# EAGLE design RGBW_controller (EAGLE 9.1.3)
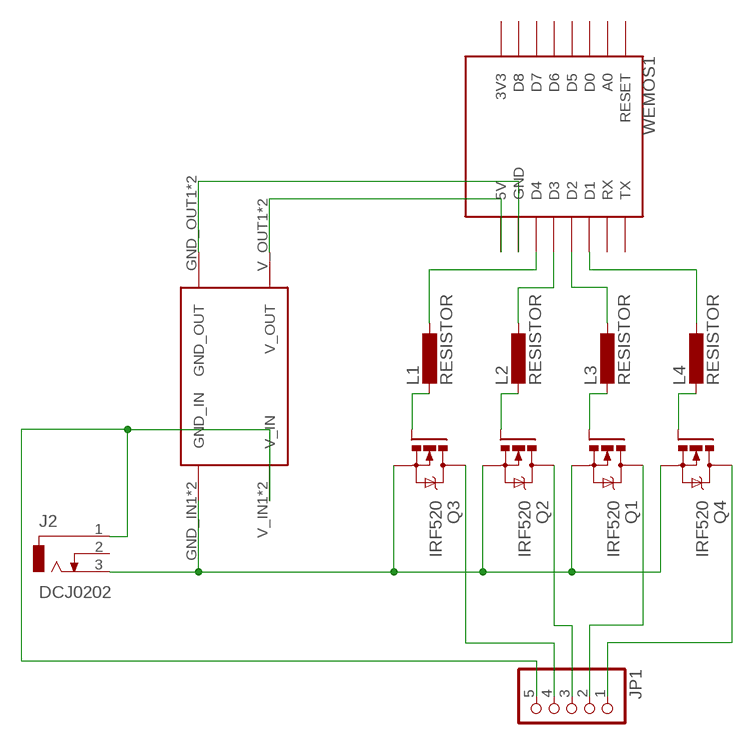
[diagram p0: schematic, sheet 1]

## Parts
J2  DCJ0202  [DCJ0202]
JP1  PINHD-1X5  [1X05]
L1  RESISTOR  [RESISTOR]
L2  RESISTOR  [RESISTOR]
L3  RESISTOR  [RESISTOR]
L4  RESISTOR  [RESISTOR]
Q1  IRF520  [TO220BV]
Q2  IRF520  [TO220BV]
Q3  IRF520  [TO220BV]
Q4  IRF520  [TO220BV]
U$1  DC-DC-CONVERTER  [DC-DC-CONVERTER]
WEMOS1  WEMOS-D1-MINI  [WEMOS-D1-MINI]

## Nets
N$1: L4.2 Q4.G
N$2: J2.3 Q1.S Q2.S Q3.S Q4.S U$1.GND_IN1(GND_IN) U$1.GND_IN2(GND_IN)
N$3: JP1.4 Q3.D
N$4: J2.1 JP1.5 U$1.V_IN1(V_IN) U$1.V_IN2(V_IN)
N$5: L1.2 Q3.G
N$6: L2.2 Q2.G
N$7: L3.2 Q1.G
N$8: L4.1 WEMOS1.D1
N$9: L3.1 WEMOS1.D2
N$10: L2.1 WEMOS1.D3
N$11: L1.1 WEMOS1.D4
N$12: U$1.V_OUT1(V_OUT) U$1.V_OUT2(V_OUT) WEMOS1.5V
N$13: U$1.GND_OUT1(GND_OUT) U$1.GND_OUT2(GND_OUT) WEMOS1.GND
N$14: JP1.3 Q2.D
N$15: JP1.2 Q1.D
N$16: JP1.1 Q4.D
Unconnected: J2.2 WEMOS1.3V3 WEMOS1.A0 WEMOS1.D0 WEMOS1.D5 WEMOS1.D6 WEMOS1.D7 WEMOS1.D8 WEMOS1.RESET WEMOS1.RX WEMOS1.TX

## Library data of the parts
J2 = con-jack:DCJ0202: DC POWER JACK Source: DCJ0202.pdf; OC_FARNELL: unknown; OC_NEWARK: unknown
JP1 = pinhead:PINHD-1X5: PIN HEADER
L1-L4 = mylib:RESISTOR
Q1-Q4 = transistor-power:IRF520: HEXFET Power MOSFET
U$1 = mylib:DC-DC-CONVERTER
WEMOS1 = esp8266modules:WEMOS-D1-MINI: WeMos.cc D1 mini ESP8266 module

## Board
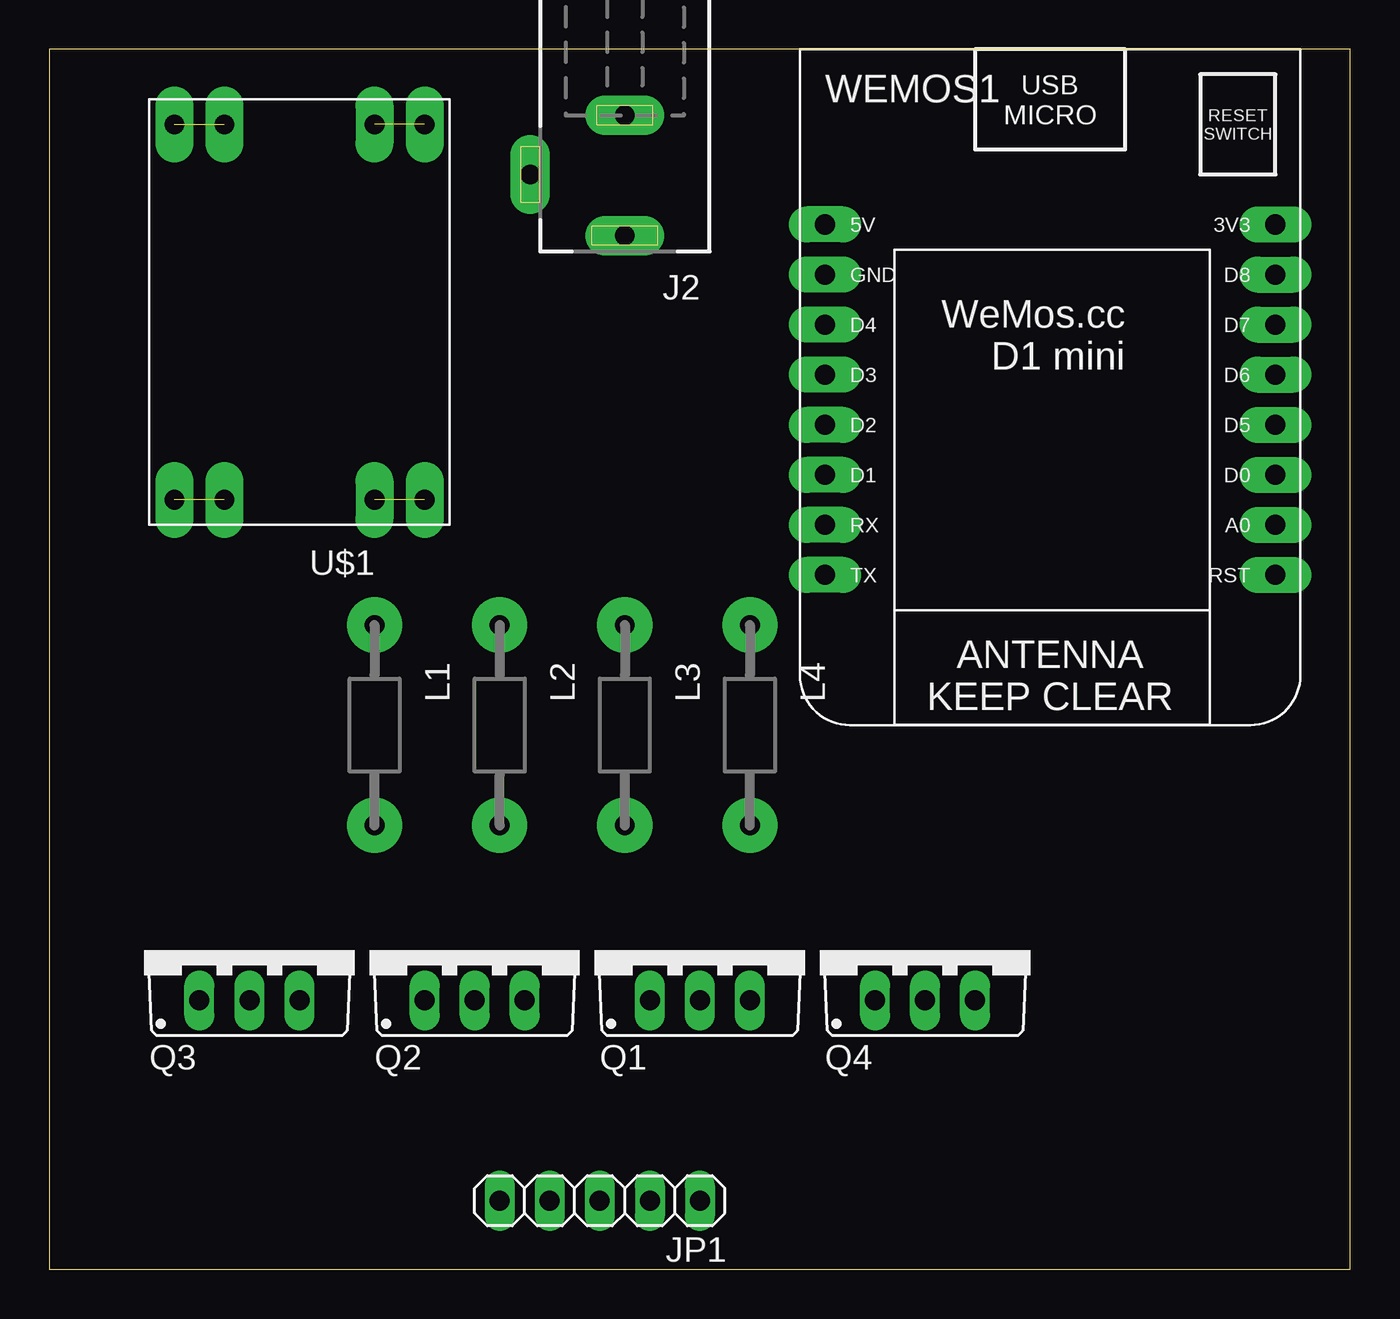
[diagram p1: board, top side]
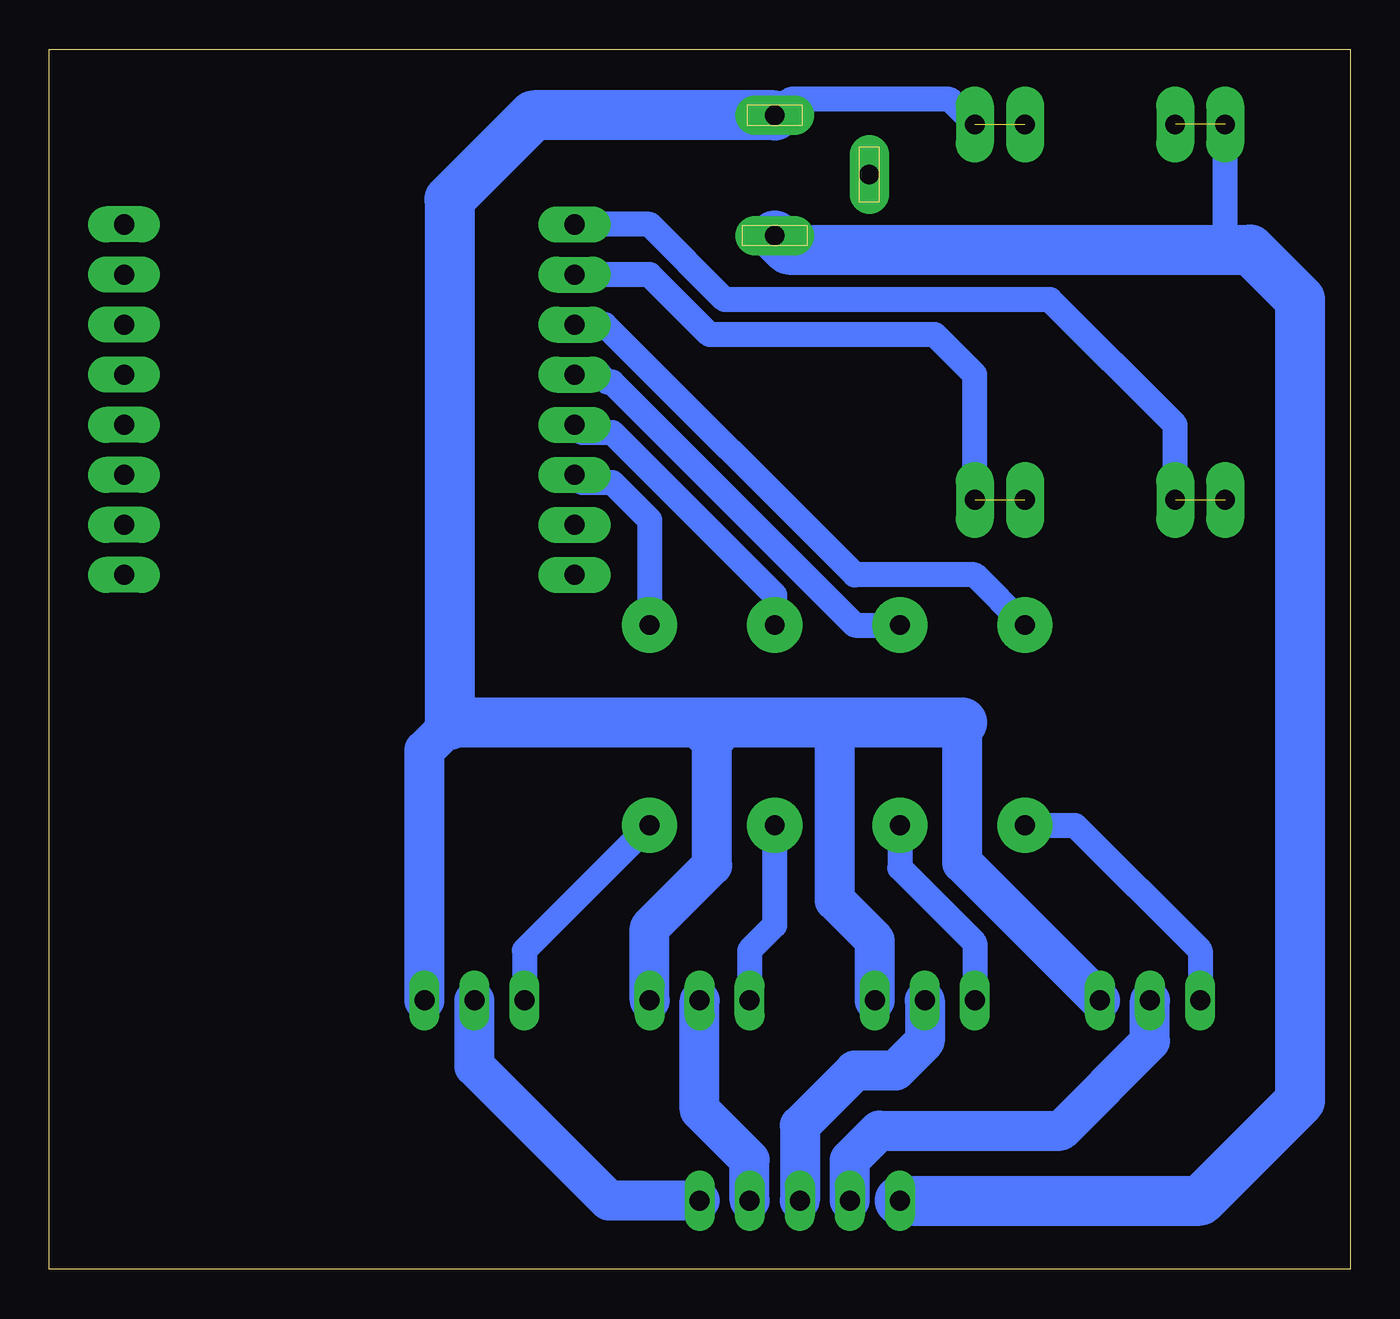
[diagram p2: board, bottom side, seen from below]

Size 66.03 x 61.9 mm. Coordinates in mm from the lower left corner, seen from the top.
Outline: 0,61.9 0,0 66.03,0 66.03,61.9 0,61.9
Copper layers (1*16): Top 0.035mm / dielectric 1.5mm / Bottom 0.035mm
Design rules "default *": minimum track width 6mil, minimum drill 0.8mm, track to track 20mil, track to pad 20mil, pad to pad 10mil, via to via 10mil, smd to smd 6mil, copper to edge 40mil, drill to drill 6mil, minimum pad ring 10mil, minimum via ring 8mil, stop-mask expansion 4mil, vias tented up to drill 0mil, thermal gap 10mil

### Footprints (pad centres in the part's own frame; a part is rotated, then mirrored left to right if it is on the bottom)
DCJ0202 = drill 1 pad 2 long: 1 0,3.1; 2 4.8,0; 3 0,-3
1X05 = drill 1.016 long: 1 -5.08,0; 2 -2.54,0; 3 0,0; 4 2.54,0; 5 5.08,0
RESISTOR = drill 1 pad 2.794: 1 -7.62,0; 2 2.54,0
TO220BV = drill 1.016 long: D 0,-2.54; G -2.54,-2.54; S 2.54,-2.54
DC-DC-CONVERTER = drill 1 pad 1.93 long: GND_IN1 -5.08,-11.43; GND_IN2 -2.54,-11.43; GND_OUT1 -5.08,7.62; GND_OUT2 -2.54,7.62; V_IN1 5.08,-11.43; V_IN2 7.62,-11.43; V_OUT1 5.08,7.62; V_OUT2 7.62,7.62
WEMOS-D1-MINI = drill 1.016 pad 1.829 long: 3V3 -10.16,-10.16; 5V 12.7,-10.16; A0 -10.16,5.08; D0 -10.16,2.54; D1 12.7,2.54; D2 12.7,0; D3 12.7,-2.54; D4 12.7,-5.08; D5 -10.16,0; D6 -10.16,-2.54; D7 -10.16,-5.08; D8 -10.16,-7.62; GND 12.7,-7.62; RESET -10.16,7.62; RX 12.7,5.08; TX 12.7,7.62

### Placement (x,y rotation side)
J2  29.21,55.55 180 top
JP1  27.94,3.48 180 top
L1  16.51,25.07 270 top
L2  22.86,25.07 270 top
L3  29.21,25.07 270 top
L4  35.56,25.07 270 top
Q1  33.02,16.18 0 top
Q2  21.59,16.18 0 top
Q3  10.16,16.18 0 top
Q4  44.45,16.18 0 top
U$1  13.97,46.66 180 top
WEMOS1  52.07,42.85 180 top

### Tracks (layer width: path | path; a pad name or v marks a point on that pad's centre or on a via)
N$1
  Bottom 1.27: L4.2 41.91,16.18 Q4.G
N$2  (1 unrouted)
  Bottom 1.27: U$1.GND_IN1 20.32,59.36 28.4,59.36 J2.3
  Bottom 2.032: Q4.S 46.99,26.34 45.72,27.61 | Q3.S 19.68,20.62 19.68,27.74 | 26.16,27.23 26.16,18.72 24.13,16.69 Q2.S | Q1.S 35.56,17.32 32.38,20.5 32.38,27.1
  Bottom 2.54: J2.3 41.45,58.55 45.72,54.28 45.72,27.61 | 45.72,27.61 | 19.68,27.74 26.67,27.74 | 26.67,27.74 33.02,27.74 | 33.02,27.74 45.59,27.74 45.72,27.61 | 26.16,27.23 26.67,27.74 | 32.38,27.1 33.02,27.74
N$3
  Bottom 2.032: JP1.4 25.4,5.55 23.91,7.04 14.7,7.04 10.16,11.57 Q3.D
N$4  (1 unrouted)
  Bottom 1.27: 6.35,51.74 U$1.V_IN2
  Bottom 2.54: J2.1 28.5,51.74 6.35,51.74 5.08,51.74 2.54,49.2 2.54,8.56 7.62,3.48 JP1.5
N$5
  Bottom 1.27: L1.2 13.97,22.53 7.62,16.18 Q3.G
N$6
  Bottom 1.27: L2.2 22.86,20.37 19.05,16.56 Q2.G
N$7
  Bottom 1.27: L3.2 29.21,17.45 30.48,16.18 Q1.G
N$8
  Bottom 1.27: WEMOS1.D1 38.99,39.93 37.46,39.93 35.56,38.03 L4.1
N$9
  Bottom 1.27: WEMOS1.D2 38.99,42.47 37.46,42.47 29.21,34.22 L3.1
N$10
  Bottom 1.27: L2.1 25.14,32.69 37.46,45.01 37.72,45.01 38.1,45.39 WEMOS1.D3
N$11
  Bottom 1.27: WEMOS1.D4 37.84,47.93 25.14,35.23 19.05,35.23 L1.1
N$12  (1 unrouted)
  Bottom 1.27: U$1.V_OUT1 8.89,42.85 15.24,49.2 31.75,49.2 35.56,53.01 WEMOS1.5V
N$13  (1 unrouted)
  Bottom 1.27: U$1.GND_OUT1 19.05,45.39 21.08,47.42 32.51,47.42 35.56,50.47 WEMOS1.GND
N$14
  Bottom 2.032: JP1.3 27.94,7.29 25.15,10.08 23.08,10.08 21.59,11.57 Q2.D
N$15
  Bottom 2.032: JP1.2 30.48,5.55 33.02,8.09 Q1.D
N$16
  Bottom 2.032: Q4.D 44.45,10.3 37.63,3.48 JP1.1